# Altium schematic sheet ZYNQ_SOC_ARM.SchDoc
size A3
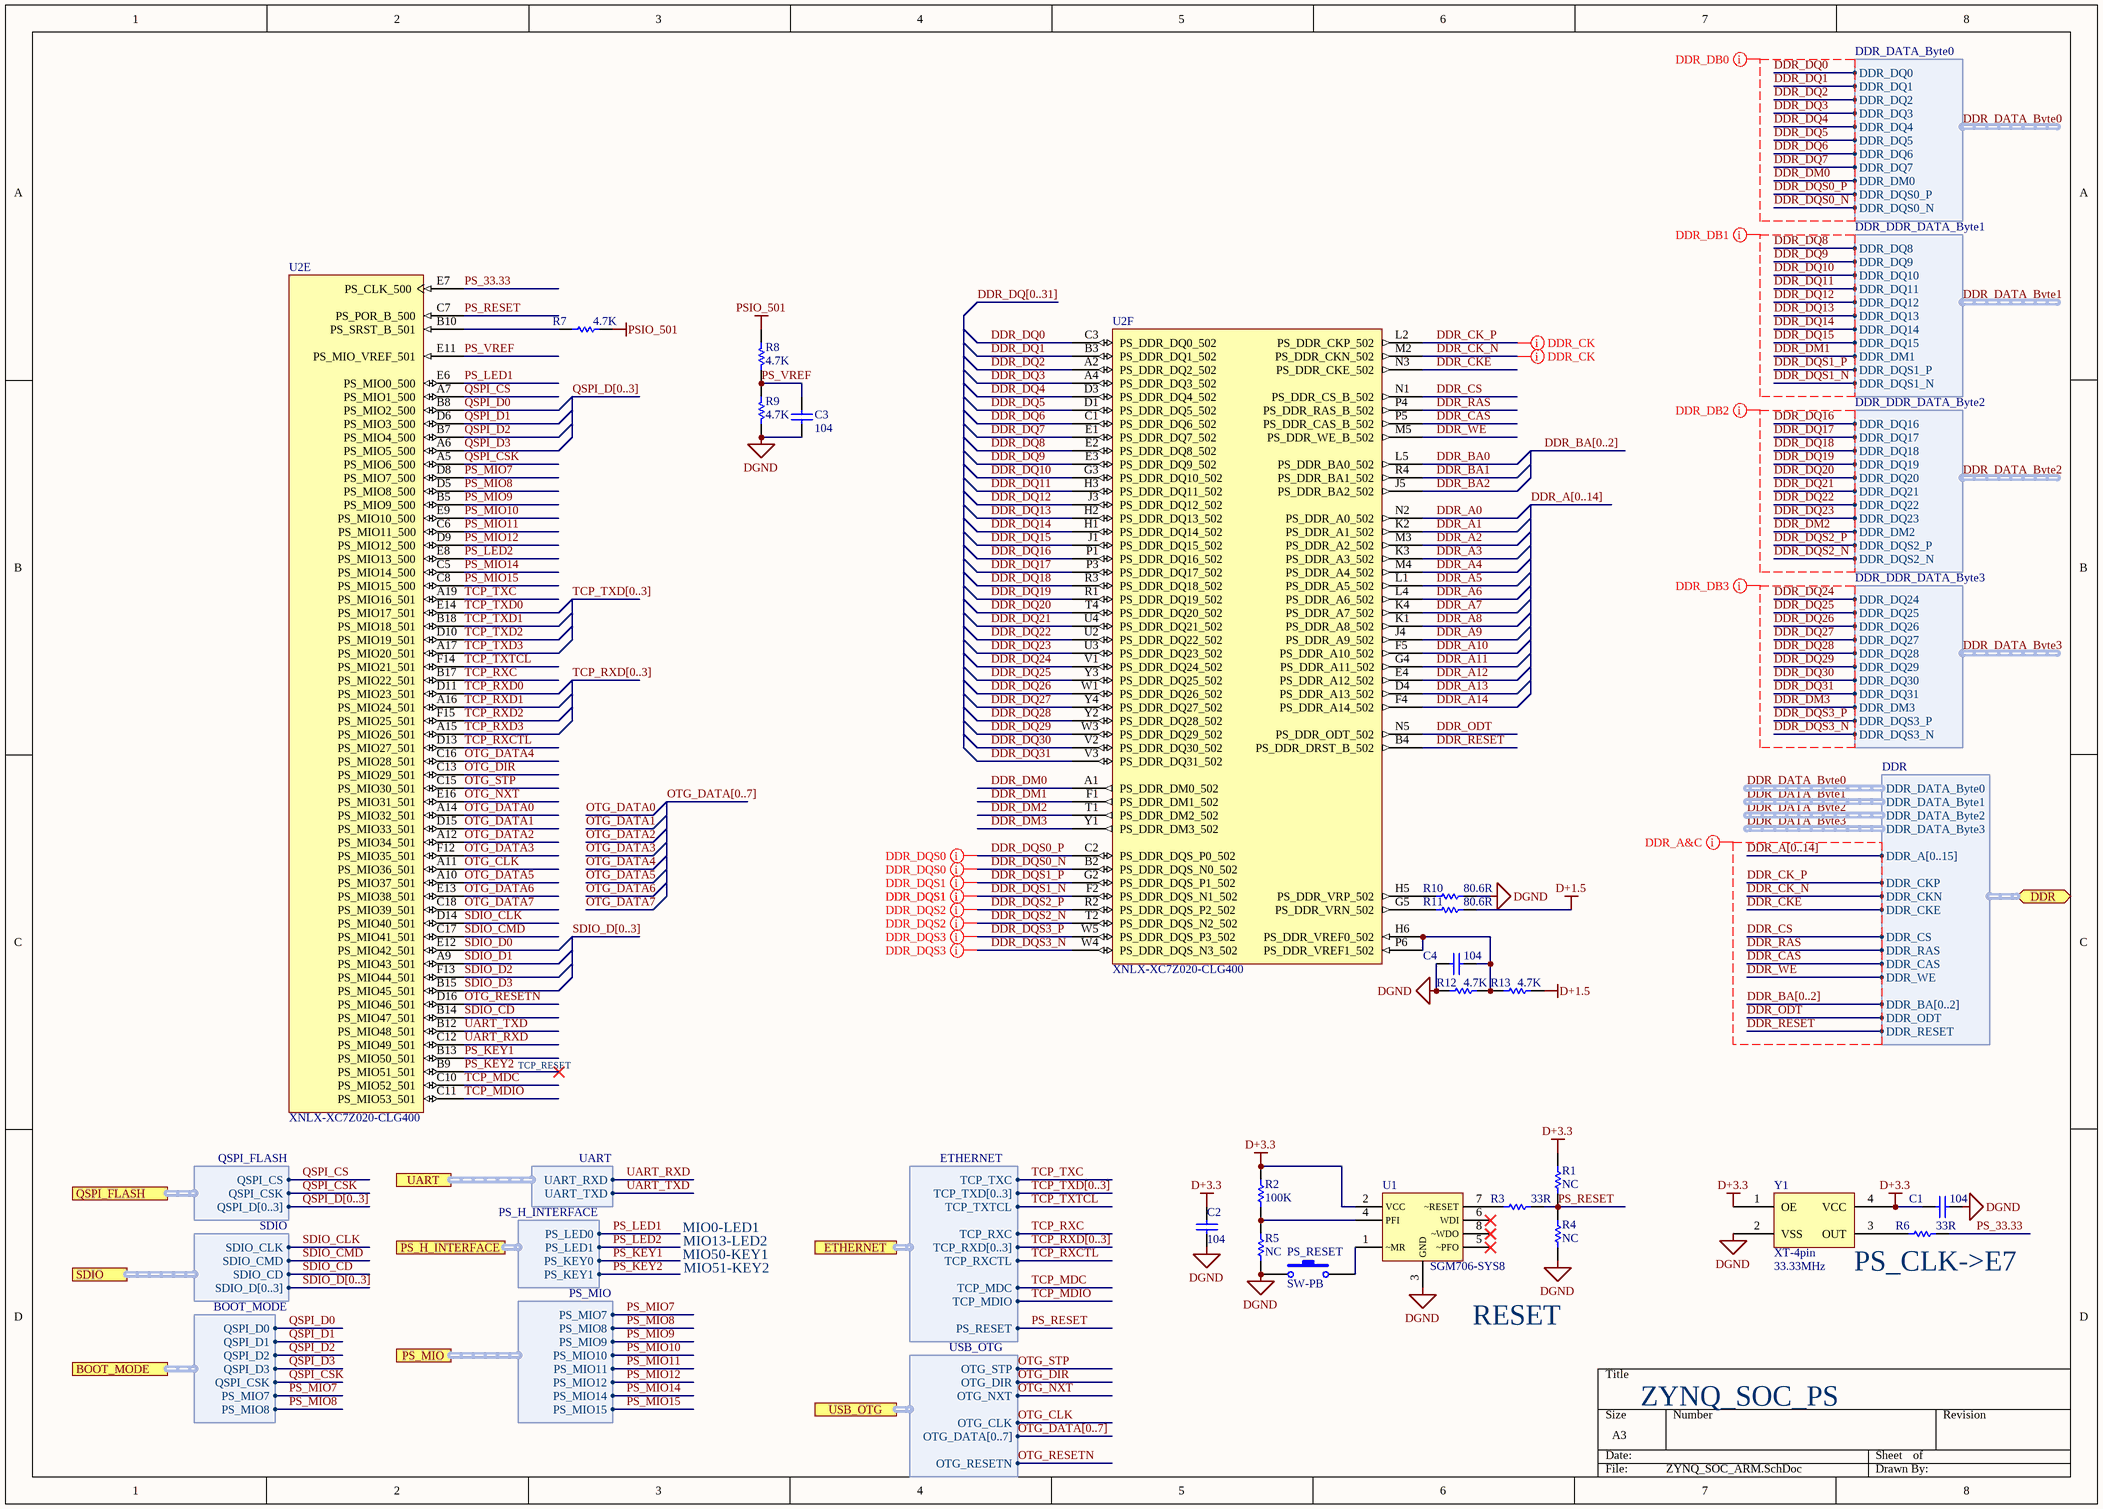
[diagram p0: ZYNQ_SOC_ARM.SchDoc]

## Parts
C1  104  [C 0402_LL]
C2  104  [C 0402_LL]
C3  104  [C 0402_LL]
C4  104  [C 0402_LL]
PS_RESET  SW-PB  [TSW SMD-3*6*4.3]
R1  NC  [R 0402_L]
R2  100K  [R 0603_L]
R3  33R  [R 0603_L]
R4  NC  [R 0402_L]
R5  NC  [R 0402_L]
R6  33R  [R 0603_L]
R7  4.7K  [R 0402_L]
R8  4.7K  [R 0402_L]
R9  4.7K  [R 0402_L]
R10  80.6R  [R 0402_L]
R11  80.6R  [R 0402_L]
R12  4.7K  [R 0402_L]
R13  4.7K  [R 0402_L]
U1  SGM706-SYS8  [SOP8_N]
U2  XNLX-XC7Z020-CLG400  [BGA400]  (parts E,F of 9)
Y1  XT-4pin  value 33.33MHz  [5032(P)]

## Ports
BOOT_MODE (harness BOOT_MODE), DDR (bidir, harness DDR), ETHERNET (harness ETHERNET), PS_H_INTERFACE (harness PS_H_INTERFACE), PS_MIO (harness PS_MIO), QSPI_FLASH (harness QSPI_FLASH), SDIO (harness SDIO), UART (harness UART), USB_OTG (harness USB_OTG)

## Harnesses
QSPI_FLASH: QSPI_CS, QSPI_CSK, QSPI_D[0..3]
SDIO: SDIO_CLK, SDIO_CMD, SDIO_D[0..3], SDIO_CD
UART: UART_RXD, UART_TXD
PS_H_INTERFACE: PS_LED0, PS_LED1, PS_KEY0, PS_KEY1
BOOT_MODE: QSPI_D0, QSPI_D1, QSPI_D3, QSPI_CSK, PS_MIO7, QSPI_D2, PS_MIO8
PS_MIO: PS_MIO7, PS_MIO8, PS_MIO9, PS_MIO10, PS_MIO11, PS_MIO12, PS_MIO14, PS_MIO15
ETHERNET: TCP_TXC, TCP_TXD[0..3], TCP_TXTCL, TCP_RXC, TCP_RXD[0..3], TCP_RXCTL, TCP_MDC, TCP_MDIO, PS_RESET
USB_OTG: OTG_STP, OTG_DIR, OTG_NXT, OTG_CLK, OTG_DATA[0..7], OTG_RESETN
DDR: DDR_A[0..15], DDR_CKP, DDR_CKN, DDR_CKE, DDR_CS, DDR_RAS, DDR_CAS, DDR_WE, DDR_DATA_Byte0, DDR_DATA_Byte1, DDR_DATA_Byte2, DDR_DATA_Byte3, DDR_BA[0..2], DDR_ODT, DDR_RESET
DDR_DDR_DATA_Byte3: DDR_DQ24, DDR_DQ25, DDR_DQ26, DDR_DQ27, DDR_DQ28, DDR_DQ29, DDR_DQ30, DDR_DQ31, DDR_DM3, DDR_DQS3_P, DDR_DQS3_N
DDR_DDR_DATA_Byte2: DDR_DQ16, DDR_DQ17, DDR_DQ18, DDR_DQ19, DDR_DQ20, DDR_DQ21, DDR_DQ22, DDR_DQ23, DDR_DM2, DDR_DQS2_P, DDR_DQS2_N
DDR_DDR_DATA_Byte1: DDR_DQ8, DDR_DQ9, DDR_DQ10, DDR_DQ11, DDR_DQ12, DDR_DQ13, DDR_DQ14, DDR_DQ15, DDR_DM1, DDR_DQS1_P, DDR_DQS1_N
DDR_DATA_Byte0: DDR_DQ0, DDR_DQ1, DDR_DQ2, DDR_DQ3, DDR_DQ4, DDR_DQ5, DDR_DQ6, DDR_DQ7, DDR_DM0, DDR_DQS0_P, DDR_DQS0_N

## Nets
D+1.5: R11.2 R13.2
D+3.3: C1.1 C2.1 R1.2 R2.2 U1.2(VCC) Y1.1(OE) Y1.4(VCC)
DGND: C1.2 C2.2 C3.1 C4.1 PS_RESET.1 R4.1 R5.1 R9.1 R10.2 R12.1 U1.3(GND) Y1.2(VSS)
PSIO_501: R7.2 R8.2
DDR_A0: U2.N2(PS_DDR_A0_502)
DDR_A1: U2.K2(PS_DDR_A1_502)
DDR_A2: U2.M3(PS_DDR_A2_502)
DDR_A3: U2.K3(PS_DDR_A3_502)
DDR_A4: U2.M4(PS_DDR_A4_502)
DDR_A5: U2.L1(PS_DDR_A5_502)
DDR_A6: U2.L4(PS_DDR_A6_502)
DDR_A7: U2.K4(PS_DDR_A7_502)
DDR_A8: U2.K1(PS_DDR_A8_502)
DDR_A9: U2.J4(PS_DDR_A9_502)
DDR_A10: U2.F5(PS_DDR_A10_502)
DDR_A11: U2.G4(PS_DDR_A11_502)
DDR_A12: U2.E4(PS_DDR_A12_502)
DDR_A13: U2.D4(PS_DDR_A13_502)
DDR_A14: U2.F4(PS_DDR_A14_502)
DDR_BA0: U2.L5(PS_DDR_BA0_502)
DDR_BA1: U2.R4(PS_DDR_BA1_502)
DDR_BA2: U2.J5(PS_DDR_BA2_502)
DDR_CAS: U2.P5(PS_DDR_CAS_B_502) ; port DDR.DDR_CAS
DDR_CK_N: U2.M2(PS_DDR_CKN_502) ; port DDR.DDR_CKN
DDR_CK_P: U2.L2(PS_DDR_CKP_502) ; port DDR.DDR_CKP
DDR_CKE: U2.N3(PS_DDR_CKE_502) ; port DDR.DDR_CKE
DDR_CS: U2.N1(PS_DDR_CS_B_502) ; port DDR.DDR_CS
DDR_DM0: U2.A1(PS_DDR_DM0_502) ; harness DDR_DATA_Byte0.DDR_DM0  [project net DDR_DATA_Byte0.DDR_DM0]
DDR_DM1: U2.F1(PS_DDR_DM1_502) ; harness DDR_DDR_DATA_Byte1.DDR_DM1  [project net DDR_DATA_Byte1.DDR_DM1]
DDR_DM2: U2.T1(PS_DDR_DM2_502) ; harness DDR_DDR_DATA_Byte2.DDR_DM2  [project net DDR_DATA_Byte2.DDR_DM2]
DDR_DM3: U2.Y1(PS_DDR_DM3_502) ; harness DDR_DDR_DATA_Byte3.DDR_DM3  [project net DDR_DATA_Byte3.DDR_DM3]
DDR_DQ0: U2.C3(PS_DDR_DQ0_502) ; harness DDR_DATA_Byte0.DDR_DQ0  [project net DDR_DATA_Byte0.DDR_DQ0]
DDR_DQ1: U2.B3(PS_DDR_DQ1_502) ; harness DDR_DATA_Byte0.DDR_DQ1  [project net DDR_DATA_Byte0.DDR_DQ1]
DDR_DQ2: U2.A2(PS_DDR_DQ2_502) ; harness DDR_DATA_Byte0.DDR_DQ2  [project net DDR_DATA_Byte0.DDR_DQ2]
DDR_DQ3: U2.A4(PS_DDR_DQ3_502) ; harness DDR_DATA_Byte0.DDR_DQ3  [project net DDR_DATA_Byte0.DDR_DQ3]
DDR_DQ4: U2.D3(PS_DDR_DQ4_502) ; harness DDR_DATA_Byte0.DDR_DQ4  [project net DDR_DATA_Byte0.DDR_DQ4]
DDR_DQ5: U2.D1(PS_DDR_DQ5_502) ; harness DDR_DATA_Byte0.DDR_DQ5  [project net DDR_DATA_Byte0.DDR_DQ5]
DDR_DQ6: U2.C1(PS_DDR_DQ6_502) ; harness DDR_DATA_Byte0.DDR_DQ6  [project net DDR_DATA_Byte0.DDR_DQ6]
DDR_DQ7: U2.E1(PS_DDR_DQ7_502) ; harness DDR_DATA_Byte0.DDR_DQ7  [project net DDR_DATA_Byte0.DDR_DQ7]
DDR_DQ8: U2.E2(PS_DDR_DQ8_502) ; harness DDR_DDR_DATA_Byte1.DDR_DQ8  [project net DDR_DATA_Byte1.DDR_DQ8]
DDR_DQ9: U2.E3(PS_DDR_DQ9_502) ; harness DDR_DDR_DATA_Byte1.DDR_DQ9  [project net DDR_DATA_Byte1.DDR_DQ9]
DDR_DQ10: U2.G3(PS_DDR_DQ10_502) ; harness DDR_DDR_DATA_Byte1.DDR_DQ10  [project net DDR_DATA_Byte1.DDR_DQ10]
DDR_DQ11: U2.H3(PS_DDR_DQ11_502) ; harness DDR_DDR_DATA_Byte1.DDR_DQ11  [project net DDR_DATA_Byte1.DDR_DQ11]
DDR_DQ12: U2.J3(PS_DDR_DQ12_502) ; harness DDR_DDR_DATA_Byte1.DDR_DQ12  [project net DDR_DATA_Byte1.DDR_DQ12]
DDR_DQ13: U2.H2(PS_DDR_DQ13_502) ; harness DDR_DDR_DATA_Byte1.DDR_DQ13  [project net DDR_DATA_Byte1.DDR_DQ13]
DDR_DQ14: U2.H1(PS_DDR_DQ14_502) ; harness DDR_DDR_DATA_Byte1.DDR_DQ14  [project net DDR_DATA_Byte1.DDR_DQ14]
DDR_DQ15: U2.J1(PS_DDR_DQ15_502) ; harness DDR_DDR_DATA_Byte1.DDR_DQ15  [project net DDR_DATA_Byte1.DDR_DQ15]
DDR_DQ16: U2.P1(PS_DDR_DQ16_502) ; harness DDR_DDR_DATA_Byte2.DDR_DQ16  [project net DDR_DATA_Byte2.DDR_DQ16]
DDR_DQ17: U2.P3(PS_DDR_DQ17_502) ; harness DDR_DDR_DATA_Byte2.DDR_DQ17  [project net DDR_DATA_Byte2.DDR_DQ17]
DDR_DQ18: U2.R3(PS_DDR_DQ18_502) ; harness DDR_DDR_DATA_Byte2.DDR_DQ18  [project net DDR_DATA_Byte2.DDR_DQ18]
DDR_DQ19: U2.R1(PS_DDR_DQ19_502) ; harness DDR_DDR_DATA_Byte2.DDR_DQ19  [project net DDR_DATA_Byte2.DDR_DQ19]
DDR_DQ20: U2.T4(PS_DDR_DQ20_502) ; harness DDR_DDR_DATA_Byte2.DDR_DQ20  [project net DDR_DATA_Byte2.DDR_DQ20]
DDR_DQ21: U2.U4(PS_DDR_DQ21_502) ; harness DDR_DDR_DATA_Byte2.DDR_DQ21  [project net DDR_DATA_Byte2.DDR_DQ21]
DDR_DQ22: U2.U2(PS_DDR_DQ22_502) ; harness DDR_DDR_DATA_Byte2.DDR_DQ22  [project net DDR_DATA_Byte2.DDR_DQ22]
DDR_DQ23: U2.U3(PS_DDR_DQ23_502) ; harness DDR_DDR_DATA_Byte2.DDR_DQ23  [project net DDR_DATA_Byte2.DDR_DQ23]
DDR_DQ24: U2.V1(PS_DDR_DQ24_502) ; harness DDR_DDR_DATA_Byte3.DDR_DQ24  [project net DDR_DATA_Byte3.DDR_DQ24]
DDR_DQ25: U2.Y3(PS_DDR_DQ25_502) ; harness DDR_DDR_DATA_Byte3.DDR_DQ25  [project net DDR_DATA_Byte3.DDR_DQ25]
DDR_DQ26: U2.W1(PS_DDR_DQ26_502) ; harness DDR_DDR_DATA_Byte3.DDR_DQ26  [project net DDR_DATA_Byte3.DDR_DQ26]
DDR_DQ27: U2.Y4(PS_DDR_DQ27_502) ; harness DDR_DDR_DATA_Byte3.DDR_DQ27  [project net DDR_DATA_Byte3.DDR_DQ27]
DDR_DQ28: U2.Y2(PS_DDR_DQ28_502) ; harness DDR_DDR_DATA_Byte3.DDR_DQ28  [project net DDR_DATA_Byte3.DDR_DQ28]
DDR_DQ29: U2.W3(PS_DDR_DQ29_502) ; harness DDR_DDR_DATA_Byte3.DDR_DQ29  [project net DDR_DATA_Byte3.DDR_DQ29]
DDR_DQ30: U2.V2(PS_DDR_DQ30_502) ; harness DDR_DDR_DATA_Byte3.DDR_DQ30  [project net DDR_DATA_Byte3.DDR_DQ30]
DDR_DQ31: U2.V3(PS_DDR_DQ31_502) ; harness DDR_DDR_DATA_Byte3.DDR_DQ31  [project net DDR_DATA_Byte3.DDR_DQ31]
DDR_DQS0_N: U2.B2(PS_DDR_DQS_N0_502) ; harness DDR_DATA_Byte0.DDR_DQS0_N  [project net DDR_DATA_Byte0.DDR_DQS0_N]
DDR_DQS0_P: U2.C2(PS_DDR_DQS_P0_502) ; harness DDR_DATA_Byte0.DDR_DQS0_P  [project net DDR_DATA_Byte0.DDR_DQS0_P]
DDR_DQS1_N: U2.F2(PS_DDR_DQS_N1_502) ; harness DDR_DDR_DATA_Byte1.DDR_DQS1_N  [project net DDR_DATA_Byte1.DDR_DQS1_N]
DDR_DQS1_P: U2.G2(PS_DDR_DQS_P1_502) ; harness DDR_DDR_DATA_Byte1.DDR_DQS1_P  [project net DDR_DATA_Byte1.DDR_DQS1_P]
DDR_DQS2_N: U2.T2(PS_DDR_DQS_N2_502) ; harness DDR_DDR_DATA_Byte2.DDR_DQS2_N  [project net DDR_DATA_Byte2.DDR_DQS2_N]
DDR_DQS2_P: U2.R2(PS_DDR_DQS_P2_502) ; harness DDR_DDR_DATA_Byte2.DDR_DQS2_P  [project net DDR_DATA_Byte2.DDR_DQS2_P]
DDR_DQS3_N: U2.W4(PS_DDR_DQS_N3_502) ; harness DDR_DDR_DATA_Byte3.DDR_DQS3_N  [project net DDR_DATA_Byte3.DDR_DQS3_N]
DDR_DQS3_P: U2.W5(PS_DDR_DQS_P3_502) ; harness DDR_DDR_DATA_Byte3.DDR_DQS3_P  [project net DDR_DATA_Byte3.DDR_DQS3_P]
DDR_ODT: U2.N5(PS_DDR_ODT_502) ; port DDR.DDR_ODT
DDR_RAS: U2.P4(PS_DDR_RAS_B_502) ; port DDR.DDR_RAS
DDR_RESET: U2.B4(PS_DDR_DRST_B_502) ; port DDR.DDR_RESET
DDR_WE: U2.M5(PS_DDR_WE_B_502) ; port DDR.DDR_WE
OTG_CLK: U2.A11(PS_MIO36_501) ; port USB_OTG.OTG_CLK
OTG_DATA0: U2.A14(PS_MIO32_501)
OTG_DATA1: U2.D15(PS_MIO33_501)
OTG_DATA2: U2.A12(PS_MIO34_501)
OTG_DATA3: U2.F12(PS_MIO35_501)
OTG_DATA4: U2.C16(PS_MIO28_501)
OTG_DATA5: U2.A10(PS_MIO37_501)
OTG_DATA6: U2.E13(PS_MIO38_501)
OTG_DATA7: U2.C18(PS_MIO39_501)
OTG_DIR: U2.C13(PS_MIO29_501) ; port USB_OTG.OTG_DIR
OTG_NXT: U2.E16(PS_MIO31_501) ; port USB_OTG.OTG_NXT
OTG_RESETN: U2.D16(PS_MIO46_501) ; port USB_OTG.OTG_RESETN
OTG_STP: U2.C15(PS_MIO30_501) ; port USB_OTG.OTG_STP
PS_33.33: R6.2 U2.E7(PS_CLK_500)
PS_KEY1: U2.B13(PS_MIO50_501) ; port PS_H_INTERFACE.PS_KEY0
PS_KEY2: U2.B9(PS_MIO51_501) ; port PS_H_INTERFACE.PS_KEY1
PS_LED1: U2.E6(PS_MIO0_500) ; port PS_H_INTERFACE.PS_LED0
PS_LED2: U2.E8(PS_MIO13_500) ; port PS_H_INTERFACE.PS_LED1
PS_MIO7: U2.D8(PS_MIO7_500) ; port BOOT_MODE.PS_MIO7, port PS_MIO.PS_MIO7
PS_MIO8: U2.D5(PS_MIO8_500) ; port BOOT_MODE.PS_MIO8, port PS_MIO.PS_MIO8
PS_MIO9: U2.B5(PS_MIO9_500) ; port PS_MIO.PS_MIO9
PS_MIO10: U2.E9(PS_MIO10_500) ; port PS_MIO.PS_MIO10
PS_MIO11: U2.C6(PS_MIO11_500) ; port PS_MIO.PS_MIO11
PS_MIO12: U2.D9(PS_MIO12_500) ; port PS_MIO.PS_MIO12
PS_MIO14: U2.C5(PS_MIO14_500) ; port PS_MIO.PS_MIO14
PS_MIO15: U2.C8(PS_MIO15_500) ; port PS_MIO.PS_MIO15
PS_RESET: R1.1 R3.2 R4.2 U2.C7(PS_POR_B_500) ; port ETHERNET.PS_RESET
PS_VREF: C3.2 R8.1 R9.2 U2.E11(PS_MIO_VREF_501)
QSPI_CS: U2.A7(PS_MIO1_500) ; port QSPI_FLASH.QSPI_CS
QSPI_CSK: U2.A5(PS_MIO6_500) ; port QSPI_FLASH.QSPI_CSK, port BOOT_MODE.QSPI_CSK
QSPI_D0: U2.B8(PS_MIO2_500) ; port BOOT_MODE.QSPI_D0
QSPI_D1: U2.D6(PS_MIO3_500) ; port BOOT_MODE.QSPI_D1
QSPI_D2: U2.B7(PS_MIO4_500) ; port BOOT_MODE.QSPI_D2
QSPI_D3: U2.A6(PS_MIO5_500) ; port BOOT_MODE.QSPI_D3
SDIO_CD: U2.B14(PS_MIO47_501) ; port SDIO.SDIO_CD
SDIO_CLK: U2.D14(PS_MIO40_501) ; port SDIO.SDIO_CLK
SDIO_CMD: U2.C17(PS_MIO41_501) ; port SDIO.SDIO_CMD
SDIO_D0: U2.E12(PS_MIO42_501)
SDIO_D1: U2.A9(PS_MIO43_501)
SDIO_D2: U2.F13(PS_MIO44_501)
SDIO_D3: U2.B15(PS_MIO45_501)
TCP_MDC: U2.C10(PS_MIO52_501) ; port ETHERNET.TCP_MDC
TCP_MDIO: U2.C11(PS_MIO53_501) ; port ETHERNET.TCP_MDIO
TCP_RXC: U2.B17(PS_MIO22_501) ; port ETHERNET.TCP_RXC
TCP_RXCTL: U2.D13(PS_MIO27_501) ; port ETHERNET.TCP_RXCTL
TCP_RXD0: U2.D11(PS_MIO23_501)
TCP_RXD1: U2.A16(PS_MIO24_501)
TCP_RXD2: U2.F15(PS_MIO25_501)
TCP_RXD3: U2.A15(PS_MIO26_501)
TCP_TXC: U2.A19(PS_MIO16_501) ; port ETHERNET.TCP_TXC
TCP_TXD0: U2.E14(PS_MIO17_501)
TCP_TXD1: U2.B18(PS_MIO18_501)
TCP_TXD2: U2.D10(PS_MIO19_501)
TCP_TXD3: U2.A17(PS_MIO20_501)
TCP_TXTCL: U2.F14(PS_MIO21_501) ; port ETHERNET.TCP_TXTCL
UART_RXD: U2.C12(PS_MIO49_501) ; port UART.UART_RXD
UART_TXD: U2.B12(PS_MIO48_501) ; port UART.UART_TXD
NetC4_2: C4.2 R12.2 R13.1 U2.H6(PS_DDR_VREF0_502) U2.P6(PS_DDR_VREF1_502)
NetPS_RESET_2: PS_RESET.2 U1.1(~MR)
NetR2_1: R2.1 R5.2 U1.4(PFI)
NetR3_1: R3.1 U1.7(~RESET)
NetR6_1: R6.1 Y1.3(OUT)
NetR7_1: R7.1 U2.B10(PS_SRST_B_501)
NetR10_1: R10.1 U2.H5(PS_DDR_VRP_502)
NetR11_1: R11.1 U2.G5(PS_DDR_VRN_502)

Not connected (* = marked no-connect by the designer): U1 5(~PFO)* 6(WDI)* 8(~WDO)*

## Buses and harness runs
bus DDR_A[0..14]
bus DDR_BA[0..2]
bus DDR_DQ[0..31]
bus OTG_DATA[0..7]
bus QSPI_D[0..3]
bus SDIO_D[0..3]
bus TCP_RXD[0..3]
bus TCP_TXD[0..3]

## Layout directives
differential pair; differential pair class DDR_DQS0: DDR_CK_N, DDR_CK_P, DDR_DATA_Byte0.DDR_DQS0_N, DDR_DATA_Byte0.DDR_DQS0_P
differential pair; differential pair class DDR_DQS1: DDR_DATA_Byte1.DDR_DQS1_N, DDR_DATA_Byte1.DDR_DQS1_P
differential pair; differential pair class DDR_DQS2: DDR_DATA_Byte2.DDR_DQS2_N, DDR_DATA_Byte2.DDR_DQS2_P
differential pair; differential pair class DDR_DQS3: DDR_DATA_Byte3.DDR_DQS3_N, DDR_DATA_Byte3.DDR_DQS3_P
net class DDR_DB0: DDR_DM0, DDR_DQ0, DDR_DQ1, DDR_DQ2, DDR_DQ3, DDR_DQ4, DDR_DQ5, DDR_DQ6, DDR_DQ7, DDR_DQS0_N, DDR_DQS0_P
net class DDR_DB1: DDR_DM1, DDR_DQ8, DDR_DQ9, DDR_DQ10, DDR_DQ11, DDR_DQ12, DDR_DQ13, DDR_DQ14, DDR_DQ15, DDR_DQS1_N, DDR_DQS1_P
net class DDR_DB2: DDR_DM2, DDR_DQ16, DDR_DQ17, DDR_DQ18, DDR_DQ19, DDR_DQ20, DDR_DQ21, DDR_DQ22, DDR_DQ23, DDR_DQS2_N, DDR_DQS2_P
net class DDR_DB3: DDR_DM3, DDR_DQ24, DDR_DQ25, DDR_DQ26, DDR_DQ27, DDR_DQ28, DDR_DQ29, DDR_DQ30, DDR_DQ31, DDR_DQS3_N, DDR_DQS3_P
net class DDR_A&C: DDR_A[0..14], DDR_BA[0..2], DDR_CAS, DDR_CK_N, DDR_CK_P, DDR_CKE, DDR_CS, DDR_ODT, DDR_RAS, DDR_RESET, DDR_WE

## Notes on the sheet
- TCP_RESET
- MIO0-LED1
- MIO13-LED2
- MIO50-KEY1
- MIO51-KEY2
- PS_CLK->E7
- RESET
- ZYNQ_SOC_PS

## Library data of the parts
C1-C4 = Cap: Capacitor; Published: 8-Jun-2000; LatestRevisionDate: 17-Jul-2002; LatestRevisionNote: Re-released for DXP Platform.; PackageReference: RAD-0.3; Publisher: Altium Limited; PackageDescription: Radial Cap, Thru-Hole; 2 Leads; 0.3 in Pin Spacing
PS_RESET = SW-PB: Switch; Published: 24-Mar-1999; LatestRevisionDate: 17-Jul-2002; LatestRevisionNote: Re-released for DXP Platform.; PackageReference: SPST-2; Publisher: Altium Limited; PackageDescription: Switch; 2 Leads
R1-R13 = Res1: Resistor; Value: 1K; Published: 8-Jun-2000; LatestRevisionDate: 17-Jul-2002; LatestRevisionNote: Re-released for DXP Platform.; PackageReference: AXIAL-0.3; Publisher: Altium Limited; PackageDescription: Axial Device, Thru-Hole; 2 Leads; 0.3 in Pin Spacing
U1 = SGM706: power supply monitoring circuitry for power on time.
U2 = XNLX-XC7Z020-CLG400: xilinx双核A9处理器与FPGA集成的SoC; Manufacturer: xilinx; value: NC
Y1 = XT-4pin: 有源晶振; Manufacturer: NC